# EAGLE design TMP (EAGLE 9.6.2)
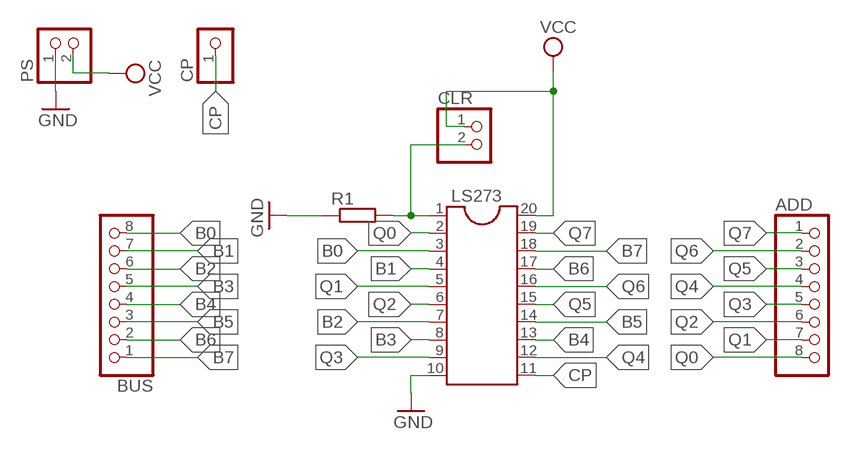
[diagram p0: schematic, sheet 1]

## Parts
ADD  PINHD-1X8  [1X08]
BUS  PINHD-1X8  [1X08]
CLR  PINHD-1X2  [1X02]
CP  PINHD-1X1  [1X01]
LS273  DIL20S  [SOCKET-20]
PS  PINHD-1X2  [1X02]
R1  R-EU_0204/7  [0204/7]

## Nets
B0: BUS.8 LS273.3
B1: BUS.7 LS273.4
B2: BUS.6 LS273.7
B3: BUS.5 LS273.8
B4: BUS.4 LS273.13
B5: BUS.3 LS273.14
B6: BUS.2 LS273.17
B7: BUS.1 LS273.18
CLR: CLR.2 LS273.1 R1.2
CP: CP.1 LS273.11
GND: LS273.10 PS.1 R1.1
Q0: ADD.8 LS273.2
Q1: ADD.7 LS273.5
Q2: ADD.6 LS273.6
Q3: ADD.5 LS273.9
Q4: ADD.4 LS273.12
Q5: ADD.3 LS273.15
Q6: ADD.2 LS273.16
Q7: ADD.1 LS273.19
VCC: CLR.1 LS273.20 PS.2

## Library data of the parts
ADD BUS = pinhead:PINHD-1X8: PIN HEADER
CLR PS = pinhead:PINHD-1X2: PIN HEADER
CP = pinhead:PINHD-1X1: PIN HEADER
LS273 = ic-package:DIL20: Dual In Line / Socket
R1 = rcl:R-EU_: RESISTOR, European symbol; SPICEPREFIX: R

## Board
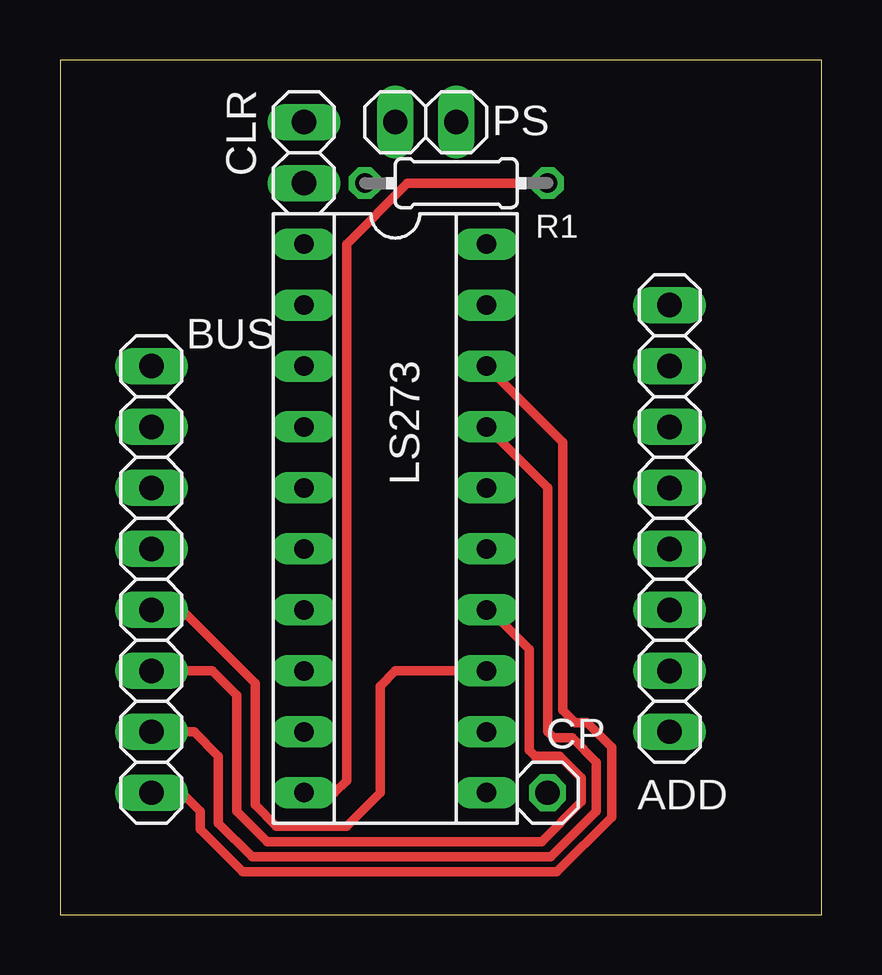
[diagram p1: board, top side]
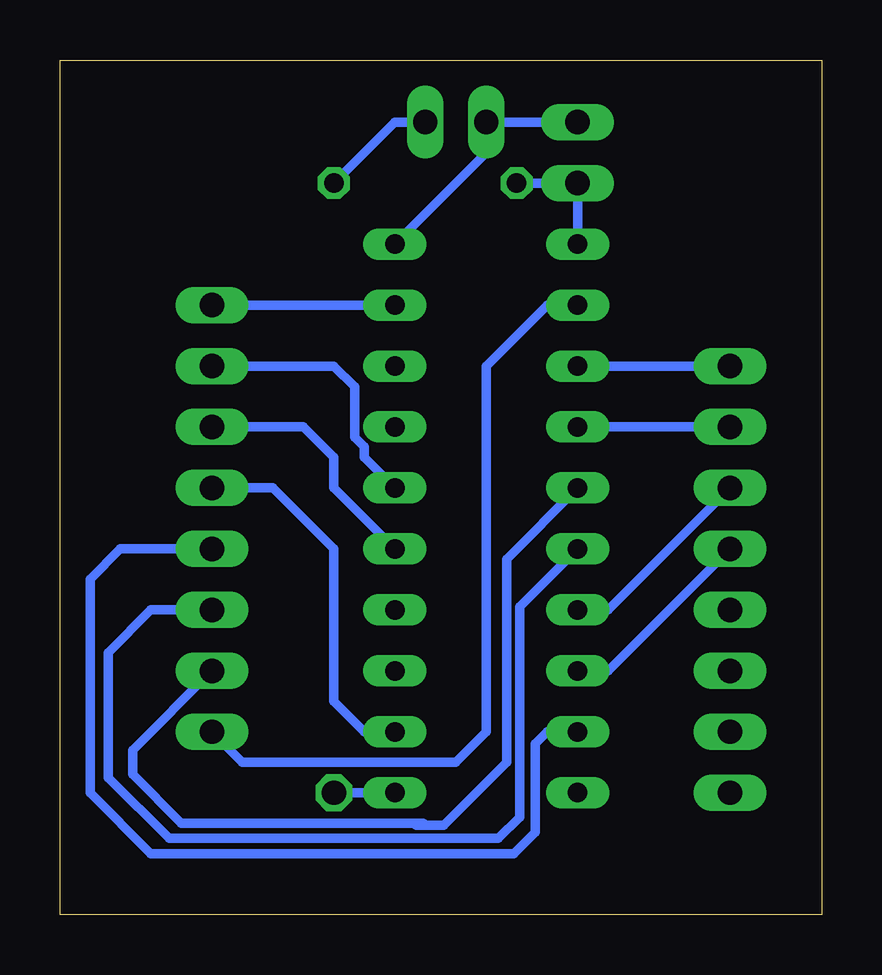
[diagram p2: board, bottom side, seen from below]

Size 31.73 x 35.61 mm. Coordinates in mm from the lower left corner, seen from the top.
Outline: 0,0 31.73,0 31.73,35.61 0,35.61 0,0
Copper layers (1*16): Top 0.035mm / dielectric 1.5mm / Bottom 0.035mm
Design rules "default": minimum track width 6mil, minimum drill 0.35mm, track to track 6mil, track to pad 6mil, pad to pad 6mil, via to via 6mil, smd to smd 6mil, copper to edge 40mil, drill to drill 6mil, minimum pad ring 10mil, minimum via ring 8mil, stop-mask expansion 4mil, vias tented up to drill 0mil, thermal gap 10mil

### Footprints (pad centres in the part's own frame; a part is rotated, then mirrored left to right if it is on the bottom)
1X08 = drill 1.016 long: 1 -8.89,0; 2 -6.35,0; 3 -3.81,0; 4 -1.27,0; 5 1.27,0; 6 3.81,0; 7 6.35,0; 8 8.89,0
1X02 = drill 1.016 long: 1 -1.27,0; 2 1.27,0
1X01 = drill 1.016 octagon: 1 0,0
SOCKET-20 = drill 0.813 long: 1 -11.43,-3.81; 2 -8.89,-3.81; 3 -6.35,-3.81; 4 -3.81,-3.81; 5 -1.27,-3.81; 6 1.27,-3.81; 7 3.81,-3.81; 8 6.35,-3.81; 9 8.89,-3.81; 10 11.43,-3.81; 11 11.43,3.81; 12 8.89,3.81; 13 6.35,3.81; 14 3.81,3.81; 15 1.27,3.81; 16 -1.27,3.81; 17 -3.81,3.81; 18 -6.35,3.81; 19 -8.89,3.81; 20 -11.43,3.81
0204/7 = drill 0.813 octagon: 1 -3.81,0; 2 3.81,0

### Placement (x,y rotation side)
ADD  25.4,16.51 270 top
BUS  3.81,13.97 90 top
CLR  10.16,31.75 270 top
CP  20.32,5.08 0 top
LS273  13.97,16.51 270 top
PS  15.24,33.02 180 top
R1  16.51,30.48 180 top

### Tracks (layer width: path | path; a pad name or v marks a point on that pad's centre or on a via)
B0
  Bottom 0.4: BUS.8 LS273.3
B1
  Bottom 0.4: LS273.4 BUS.7
B2
  Bottom 0.4: BUS.6 8.89,12.7 LS273.7
B3
  Bottom 0.4: BUS.5 8.89,10.16 LS273.8
B4
  Top 0.4: BUS.4 5.08,12.7 8.13,9.65 8.13,4.57 9.02,3.68 11.94,3.68 13.34,5.08 13.34,9.53 13.97,10.16 LS273.13
B5
  Top 0.4: BUS.3 6.35,10.16 7.37,9.14 7.37,4.32 8.64,3.05 20.07,3.05 21.72,4.7 21.72,5.71 20.83,6.6 19.81,6.6 19.56,6.86 19.56,11.05 17.91,12.7 LS273.14
B6
  Top 0.4: BUS.2 5.59,7.62 6.6,6.6 6.6,3.81 8,2.41 20.45,2.41 22.35,4.32 22.35,6.35 21.34,7.37 20.57,7.37 20.32,7.62 20.32,17.78 LS273.17
B7
  Top 0.4: BUS.1 5.08,5.08 5.84,4.32 5.84,3.56 7.62,1.78 20.7,1.78 22.99,4.06 22.99,6.99 21.97,8 21.46,8 20.95,8.51 20.95,19.68 LS273.18
CLR
  Bottom 0.4: LS273.1 CLR.2 R1.2
CP
  Bottom 0.4: LS273.11 CP.1
GND
  Top 0.4: LS273.10 11.43,5.08 11.94,5.59 11.94,27.94 14.48,30.48 R1.1
  Bottom 0.4: PS.1 17.78,33.02 R1.1
Q0
  Bottom 0.4: ADD.8 24.13,6.35 15.24,6.35 13.97,7.62 13.97,22.86 11.43,25.4 LS273.2
Q1
  Bottom 0.4: LS273.5 13.12,14.81 13.12,6.35 15.75,3.73 16.51,3.73 | 16.51,3.73 16.89,3.73 | 16.51,3.73 16.59,3.81 26.67,3.81 28.7,5.84 28.7,6.86 ADD.7
Q2
  Bottom 0.4: ADD.6 27.94,12.7 29.72,10.92 29.72,5.71 27.18,3.17 13.46,3.17 12.57,4.06 12.57,12.83 LS273.6
Q3
  Bottom 0.4: LS273.9 11.43,7.62 11.94,7.11 11.94,3.43 12.83,2.54 27.94,2.54 30.48,5.08 30.48,13.97 29.21,15.24 ADD.5
Q4
  Bottom 0.4: LS273.12 19.05,7.62 20.32,8.89 20.32,15.24 22.86,17.78 ADD.4
Q5
  Bottom 0.4: ADD.3 21.59,20.32 20.32,19.05 20.32,17.78 LS273.15
Q6
  Bottom 0.4: ADD.2 20.32,22.86 19.45,21.99 19.45,19.9 19.05,19.5 19.05,19.05 LS273.16
Q7
  Bottom 0.4: LS273.19 ADD.1
VCC
  Bottom 0.4: CLR.1 PS.2 13.97,31.75 LS273.20